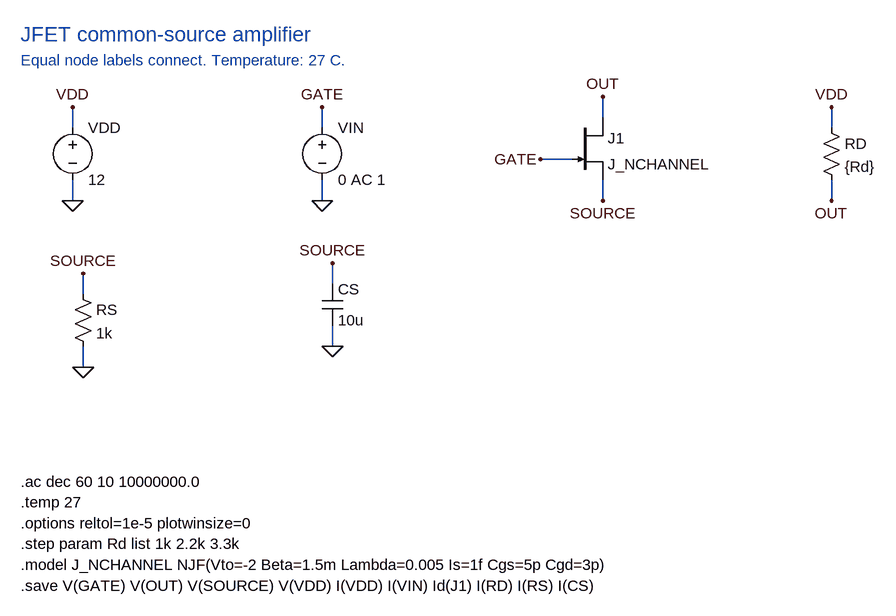
[diagram p0: schematic jfet-common-source.asc]
jfet-common-source.asc, the LTspice schematic file:
Version 4
SHEET 1 1740 1032
WIRE 144 176 144 144
WIRE 144 256 144 288
WIRE 528 176 528 144
WIRE 528 256 528 288
WIRE 960 160 960 128
WIRE 912 224 864 224
WIRE 960 256 960 288
WIRE 1312 176 1312 144
WIRE 1312 256 1312 288
WIRE 160 432 160 400
WIRE 160 512 160 544
WIRE 544 416 544 384
WIRE 544 480 544 512
FLAG 144 144 VDD
FLAG 144 288 0
FLAG 528 144 GATE
FLAG 528 288 0
FLAG 960 128 OUT
FLAG 864 224 GATE
FLAG 960 288 SOURCE
FLAG 1312 144 VDD
FLAG 1312 288 OUT
FLAG 160 400 SOURCE
FLAG 160 544 0
FLAG 544 384 SOURCE
FLAG 544 512 0
SYMBOL voltage 144 160 R0
SYMATTR InstName VDD
SYMATTR Value 12
SYMBOL voltage 528 160 R0
SYMATTR InstName VIN
SYMATTR Value 0 AC 1
SYMBOL njf 912 160 R0
SYMATTR InstName J1
SYMATTR Value J_NCHANNEL
SYMBOL res 1296 160 R0
SYMATTR InstName RD
SYMATTR Value {Rd}
SYMBOL res 144 416 R0
SYMATTR InstName RS
SYMATTR Value 1k
SYMBOL cap 528 416 R0
SYMATTR InstName CS
SYMATTR Value 10u
TEXT 64 32 Left 3 ;JFET common-source amplifier
TEXT 64 72 Left 2 ;Equal node labels connect. Temperature: 27 C.
TEXT 64 720 Left 2 !.ac dec 60 10 10000000.0
TEXT 64 752 Left 2 !.temp 27
TEXT 64 784 Left 2 !.options reltol=1e-5 plotwinsize=0
TEXT 64 816 Left 2 !.step param Rd list 1k 2.2k 3.3k
TEXT 64 848 Left 2 !.model J_NCHANNEL NJF(Vto=-2 Beta=1.5m Lambda=0.005 Is=1f Cgs=5p Cgd=3p)
TEXT 64 880 Left 2 !.save V(GATE) V(OUT) V(SOURCE) V(VDD) I(VDD) I(VIN) Id(J1) I(RD) I(RS) I(CS)

The netlist it stands for:
* jfet-common-source.asc
VDD VDD 0 12
VIN GATE 0 0 AC 1
J1 OUT GATE SOURCE J_NCHANNEL
RD VDD OUT {Rd}
RS SOURCE 0 1k
CS SOURCE 0 10u
.model NJF NJF
.model PJF PJF
.lib standard.jft
* JFET common-source amplifier
* Equal node labels connect. Temperature: 27 C.
.ac dec 60 10 10000000.0
.temp 27
.options reltol=1e-5 plotwinsize=0
.step param Rd list 1k 2.2k 3.3k
.model J_NCHANNEL NJF(Vto=-2 Beta=1.5m Lambda=0.005 Is=1f Cgs=5p Cgd=3p)
.save V(GATE) V(OUT) V(SOURCE) V(VDD) I(VDD) I(VIN) Id(J1) I(RD) I(RS) I(CS)
.backanno
.end